# Altium schematic sheet Power_Sources.SchDoc
size A
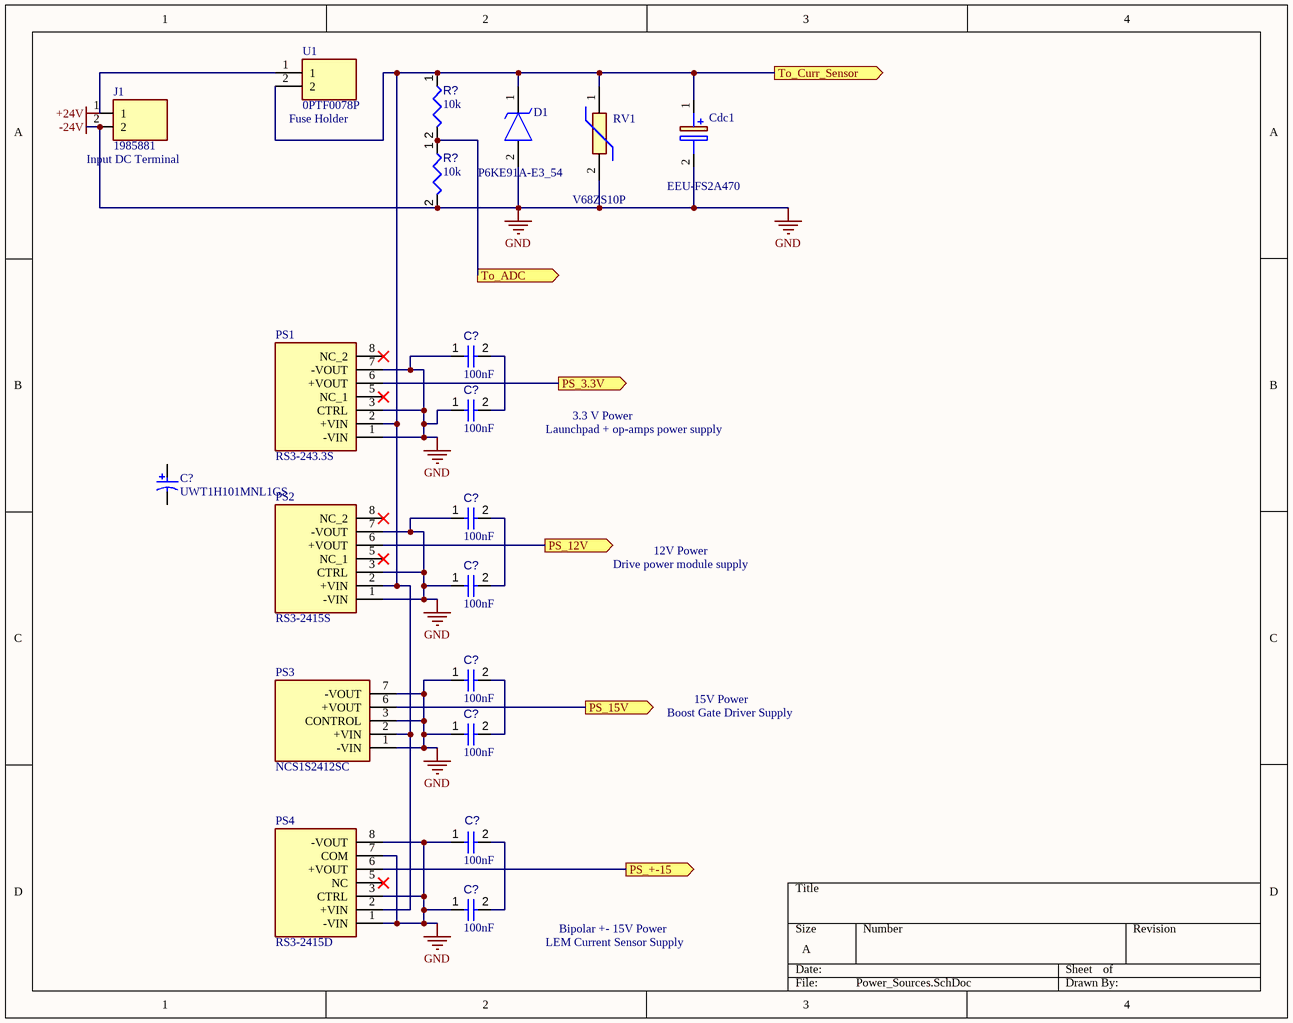
[diagram p0: Power_Sources.SchDoc]

## Parts
(Parts that share a designator on the sheet are numbered #1, #2 ... from top to bottom, then left to right.)
C?#1  value 100nF  [CAPC0402(1005)60_L]  (hidden comment: Capacitor 100nF +/-20% 50V 0402)
C?#2  value 100nF  [CAPC0402(1005)60_L]  (hidden comment: Capacitor 100nF +/-20% 50V 0402)
C?#3  UWT1H101MNL1GS  [NIC-UWT1H101MNL1GS_L]
C?#4  value 100nF  [CAPC0402(1005)60_L]  (hidden comment: Capacitor 100nF +/-20% 50V 0402)
C?#5  value 100nF  [CAPC0402(1005)60_L]  (hidden comment: Capacitor 100nF +/-20% 50V 0402)
C?#6  value 100nF  [CAPC0402(1005)60_L]  (hidden comment: Capacitor 100nF +/-20% 50V 0402)
C?#7  value 100nF  [CAPC0402(1005)60_L]  (hidden comment: Capacitor 100nF +/-20% 50V 0402)
C?#8  value 100nF  [CAPC0402(1005)60_L]  (hidden comment: Capacitor 100nF +/-20% 50V 0402)
C?#9  value 100nF  [CAPC0402(1005)60_L]  (hidden comment: Capacitor 100nF +/-20% 50V 0402)
Cdc1  EEU-FS2A470  [CAPPRD350W65D800H1650]
D1  P6KE91A-E3_54  [DIOAD1910W86L670D310]
J1  1985881  [1985881]
PS1  RS3-243.3S  [RS32433S]
PS2  RS3-2415S  [RS32415S]
PS3  NCS1S2412SC  [NCS1S2412SC]
PS4  RS3-2415D  [RS32405DH3]
R?#1  value 10k  [RESC1608X55X25ML10T15]  (hidden comment: Resistor 10k +/-1% 0603 100 mW)
R?#2  value 10k  [RESC1608X55X25ML10T15]  (hidden comment: Resistor 10k +/-1% 0603 100 mW)
RV1  V68ZS10P  [V68ZS10P]
U1  0PTF0078P  [0PTF0078P]

## Ports
PS_3.3V (out), PS_12V (out), PS_15V (out), PS_+-15 (out), To_ADC (out), To_Curr_Sensor (out)

## Nets
+24V: U1.1
-24V: C?#1.1 C?#2.1 C?#4.1 C?#5.1 C?#6.1 C?#7.1 C?#8.1 C?#9.1 Cdc1.2(-) D1.2(A) J1.2 PS1.1(-VIN) PS1.3(CTRL) PS1.7(-VOUT) PS2.1(-VIN) PS2.3(CTRL) PS2.7(-VOUT) PS3.1(-VIN) PS3.3(CONTROL) PS3.7(-VOUT) PS4.1(-VIN) PS4.3(CTRL) PS4.7(COM) PS4.8(-VOUT) R?#2.2 RV1.2  [also labelled GND]
PS_3.3V: PS1.6(+VOUT) ; port PS_3.3V
PS_12V: PS2.6(+VOUT) ; port PS_12V
PS_15V: PS3.6(+VOUT) ; port PS_15V
PS_+-15: PS4.6(+VOUT) ; port PS_+-15
To_ADC: R?#1.2 R?#2.1 ; port To_ADC
To_Curr_Sensor: Cdc1.1(+) D1.1(K) PS1.2(+VIN) PS2.2(+VIN) PS3.2(+VIN) PS4.2(+VIN) R?#1.1 RV1.1 U1.2 ; port To_Curr_Sensor
NetC?#1_2: C?#1.2 C?#2.2
NetC?#4_2: C?#4.2 C?#5.2
NetC?#6_2: C?#6.2 C?#7.2
NetC?#8_2: C?#8.2 C?#9.2

Not connected (* = marked no-connect by the designer): C?#3 1 2; J1 1; PS1 5(NC_1)* 8(NC_2)*; PS2 5(NC_1)* 8(NC_2)*; PS4 5(NC)*

## Notes on the sheet
- (near J1) Input DC Terminal
- (near U1) Fuse Holder
- Launchpad + op-amps power supply
- 3.3 V Power
- Drive power module supply
- 12V Power
- 15V Power
- Boost Gate Driver Supply
- LEM Current Sensor Supply
- Bipolar +- 15V Power

## Library data of the parts
C?#1 C?#2 C?#4-C?#9 = CMP-001-00067-3: Chip Capacitor, 100nF +/-20%, 50V, 0402, Thickness 0.6 mm; Tolerance: 10%; Min Operating Temperature: -55°C; Pins: 2; Case/Package: 0402; Max Operating Temperature: 85°C; Voltage Rating: 50V; Mounting Technology: SMT
C?#3 = CMP-2000-07373-1: Aluminum Electrolytic Capacitor, 100 uF, +/- 20%, 50 V, -55 to 105 degC, 2-Pin SMD, RoHS, Tape and Reel; Manufacturer: Nichicon; Capacitance: 100µF; Type: Can; Rated Voltage: 50V; Datasheet Version: 08/2015; Operating Temp-Max: 105°C; Mounting Technology: SurfaceMount; Datasheet URL: http://products.nichicon.co.jp/en/pdf/XJA043/e-uwt.pdf; Package Description: Aluminum Electrolytic Capacitor, Body 8.3 x 8.3 mm, Height 10.8 mm; Package Reference: UWT1H101MNL1GS; Case Size/Dimension: Ø8x10mm; Manufacturer URL: http://www.nichicon.co.jp/english/
Cdc1 = EEU-FS2A470: Capacitor Polarised; Manufacturer_Name: Panasonic; Datasheet Link: https://componentsearchengine.com/Datasheets/1/EEU-FS2A470.pdf; Height: 16.5mm; Manufacturer_Part_Number: EEU-FS2A470; Mouser Part Number: 667-EEU-FS2A470; Mouser Price/Stock: https://www.mouser.co.uk/ProductDetail/Panasonic/EEU-FS2A470?qs=w%2Fv1CP2dgqrDlaRaE647gA%3D%3D; Arrow Part Number: EEU-FS2A470; Arrow Price/Stock: https://www.arrow.com/en/products/eeu-fs2a470/panasonic
D1 = P6KE91A-E3_54: TVS Diode (Uni-directional); Manufacturer_Name: Vishay; Manufacturer_Part_Number: P6KE91A-E3/54; Datasheet Link: https://www.mouser.com/datasheet/2/427/p6ke-1767850.pdf
J1 = 1985881: Connector; Manufacturer_Name: Phoenix Contact; Datasheet Link: https://www.digikey.com/en/products/detail/phoenix-contact/1985881/2511015; Height: 13.9mm; Manufacturer_Part_Number: 1985881
PS1 = RS3-243.3S: Power Supply; Manufacturer_Name: RECOM Power; Datasheet Link: https://www.arrow.com/en/products/rs3-243.3s/recom-power; Height: 11.35mm; Manufacturer_Part_Number: RS3-243.3S; Mouser Part Number: 919-RS3-243.3S; Mouser Price/Stock: https://www.mouser.com/Search/Refine.aspx?Keyword=919-RS3-243.3S; Arrow Part Number: RS3-243.3S; Arrow Price/Stock: https://www.arrow.com/en/products/rs3-243.3s/recom-power
PS2 = RS3-2415S: Power Supply; Manufacturer_Name: RECOM Power; Datasheet Link: https://www.recom-power.com/pdf/Econoline/RS3-S_D_Z.pdf; Height: 11.35mm; Manufacturer_Part_Number: RS3-2415S; Mouser Part Number: 919-RS3-2415S; Mouser Price/Stock: https://www.mouser.com/Search/Refine.aspx?Keyword=919-RS3-2415S
PS3 = NCS1S2412SC: Power Supply; Manufacturer_Name: Murata Electronics; Datasheet Link: https://power.murata.com/data/power/ncl/kdc_ncs1.pdf; Height: 11.3mm; Manufacturer_Part_Number: NCS1S2412SC; Mouser Part Number: 580-NCS1S2412SC; Mouser Price/Stock: https://www.mouser.com/Search/Refine.aspx?Keyword=580-NCS1S2412SC; Arrow Part Number: NCS1S2412SC; Arrow Price/Stock: https://www.arrow.com/en/products/ncs1s2412sc/murata-power-solutions
PS4 = RS3-2415D: Power Supply; Manufacturer_Name: RECOM Power; Allied_Number: 70052275; Datasheet Link: https://www.recom-power.com/pdf/Econoline/RS3-S_D_Z.pdf; Height: 11.35mm; Manufacturer_Part_Number: RS3-2415D; Mouser Part Number: 919-RS3-2415D; Mouser Price/Stock: https://www.mouser.com/Search/Refine.aspx?Keyword=919-RS3-2415D; RS Part Number: 1669089; RS Price/Stock: https://uk.rs-online.com/web/p/products/1669089; Allied Price/Stock: https://www.alliedelec.com/recom-power-inc-rs3-2415d/70052275/
R?#1 R?#2 = CMP-009-00017-5: Chip Resistor, 10 KOhm, +/- 1%, 01 W, -55 to 155 degC, 0603 (1608 Metric); Voltage Rating: 50V; Power: 100mW; RoHS Compliant: True; Min Operating Temperature: -55°C; Pins: 2; Case/Package: 0603; Mounting Technology: SM; Max Operating Temperature: 155°C; Tolerance: 1%
RV1 = V68ZS10P: Varistor; Manufacturer_Name: LITTELFUSE; Datasheet Link: http://www.littelfuse.com/~/media/electronics/datasheets/varistors/littelfuse_varistor_za_datasheet.pdf.pdf; Height: 20mm; Manufacturer_Part_Number: V68ZS10P; Mouser Part Number: 576-V68ZS10P; Mouser Price/Stock: https://www.mouser.co.uk/ProductDetail/Littelfuse/V68ZS10P?qs=1%2FWRN91BpNvIRlTsONWDiQ%3D%3D
U1 = 0PTF0078P: Undefined or Miscellaneous; Manufacturer_Name: LITTELFUSE; Datasheet Link: https://media.digikey.com/pdf/Data%20Sheets/Littelfuse%20PDFs/PTF075_77_78.pdf; Height: 11.5mm; Manufacturer_Part_Number: 0PTF0078P; Mouser Part Number: 576-0PTF0078P; Mouser Price/Stock: https://www.mouser.co.uk/ProductDetail/Littelfuse/0PTF0078P?qs=Co4VkB5J4%2Fsczy6gG8s%2FsA%3D%3D; Arrow Part Number: 0PTF0078P; Arrow Price/Stock: https://www.arrow.com/en/products/0ptf0078p/littelfuse